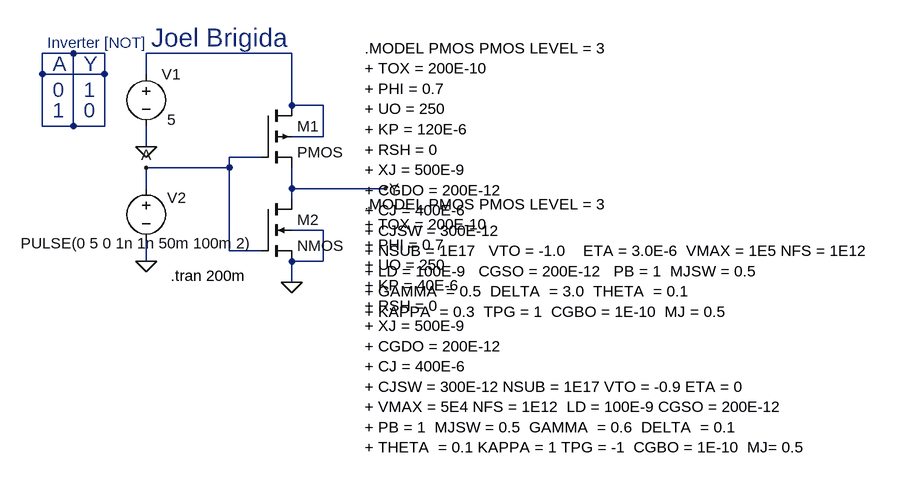
[diagram p0: schematic Inverter.asc]
Inverter.asc, the LTspice schematic file:
Version 4
SHEET 1 1240 680
WIRE -112 -32 -160 -32
WIRE -64 -32 -112 -32
WIRE 224 -32 0 -32
WIRE -160 0 -160 -32
WIRE -64 0 -64 -32
WIRE -64 0 -160 0
WIRE 0 0 0 -32
WIRE 224 48 224 -32
WIRE 272 48 224 48
WIRE -160 80 -160 0
WIRE -112 80 -112 -32
WIRE -112 80 -160 80
WIRE -64 80 -64 0
WIRE -64 80 -112 80
WIRE 272 96 272 48
WIRE 272 96 224 96
WIRE 0 112 0 80
WIRE 176 128 128 128
WIRE 128 144 128 128
WIRE 128 144 0 144
WIRE 0 176 0 144
WIRE 224 176 224 144
WIRE 368 176 224 176
WIRE 224 192 224 176
WIRE 272 240 224 240
WIRE 128 272 128 144
WIRE 176 272 128 272
WIRE 0 288 0 256
WIRE 272 288 272 240
WIRE 272 288 224 288
WIRE 224 320 224 288
FLAG 224 320 0
FLAG 0 112 0
FLAG 0 288 0
FLAG 368 176 Y
FLAG 0 144 A
SYMBOL pmos4 176 48 R0
SYMATTR InstName M1
SYMBOL nmos4 176 192 R0
SYMATTR InstName M2
SYMBOL voltage 0 -16 R0
WINDOW 123 0 0 Left 0
WINDOW 39 0 0 Left 0
WINDOW 3 32 86 Left 2
SYMATTR InstName V1
SYMATTR Value 5
SYMBOL voltage 0 160 R0
WINDOW 123 0 0 Left 0
WINDOW 39 0 0 Left 0
WINDOW 0 32 30 Left 2
WINDOW 3 -193 100 Left 2
SYMATTR InstName V2
SYMATTR Value PULSE(0 5 0 1n 1n 50m 100m 2)
TEXT 336 200 Left 2 !.MODEL PMOS PMOS LEVEL = 3\n+ TOX = 200E-10\n+ PHI = 0.7\n+ UO = 250 \n+ KP = 40E-6\n+ RSH = 0\n+ XJ = 500E-9 \n+ CGDO = 200E-12 \n+ CJ = 400E-6\n+ CJSW = 300E-12 NSUB = 1E17 VTO = -0.9 ETA = 0\n+ VMAX = 5E4 NFS = 1E12  LD = 100E-9 CGSO = 200E-12\n+ PB = 1  MJSW = 0.5  GAMMA  = 0.6  DELTA  = 0.1\n+ THETA  = 0.1 KAPPA = 1 TPG = -1  CGBO = 1E-10  MJ= 0.5
TEXT 336 -40 Left 2 !.MODEL PMOS PMOS LEVEL = 3\n+ TOX = 200E-10\n+ PHI = 0.7\n+ UO = 250\n+ KP = 120E-6\n+ RSH = 0\n+ XJ = 500E-9\n+ CGDO = 200E-12\n+ CJ = 400E-6\n+ CJSW = 300E-12\n+ NSUB = 1E17   VTO = -1.0    ETA = 3.0E-6  VMAX = 1E5 NFS = 1E12   \n+ LD = 100E-9   CGSO = 200E-12   PB = 1  MJSW = 0.5\n+ GAMMA  = 0.5  DELTA  = 3.0  THETA  = 0.1\n+ KAPPA  = 0.3  TPG = 1  CGBO = 1E-10  MJ = 0.5
TEXT 8 -56 Left 4 ;Joel Brigida
TEXT -144 -16 Left 3 ;A
TEXT -96 -16 Left 3 ;Y
TEXT -144 24 Left 3 ;0
TEXT -96 56 Left 3 ;0
TEXT -144 56 Left 3 ;1
TEXT -96 24 Left 3 ;1
TEXT -152 -48 Left 2 ;Inverter [NOT]
TEXT 38 310 Left 2 !.tran 200m

The netlist it stands for:
* Inverter.asc
M1 N002 A Y N002 PMOS
M2 Y A 0 0 NMOS
V1 N002 0 5
V2 A 0 PULSE(0 5 0 1n 1n 50m 100m 2)
.model NMOS NMOS
.model PMOS PMOS
.lib standard.mos
.MODEL PMOS PMOS LEVEL = 3
+ TOX = 200E-10
+ PHI = 0.7
+ UO = 250
+ KP = 40E-6
+ RSH = 0
+ XJ = 500E-9
+ CGDO = 200E-12
+ CJ = 400E-6
+ CJSW = 300E-12 NSUB = 1E17 VTO = -0.9 ETA = 0
+ VMAX = 5E4 NFS = 1E12  LD = 100E-9 CGSO = 200E-12
+ PB = 1  MJSW = 0.5  GAMMA  = 0.6  DELTA  = 0.1
+ THETA  = 0.1 KAPPA = 1 TPG = -1  CGBO = 1E-10  MJ= 0.5
.MODEL PMOS PMOS LEVEL = 3
+ TOX = 200E-10
+ PHI = 0.7
+ UO = 250
+ KP = 120E-6
+ RSH = 0
+ XJ = 500E-9
+ CGDO = 200E-12
+ CJ = 400E-6
+ CJSW = 300E-12
+ NSUB = 1E17   VTO = -1.0    ETA = 3.0E-6  VMAX = 1E5 NFS = 1E12
+ LD = 100E-9   CGSO = 200E-12   PB = 1  MJSW = 0.5
+ GAMMA  = 0.5  DELTA  = 3.0  THETA  = 0.1
+ KAPPA  = 0.3  TPG = 1  CGBO = 1E-10  MJ = 0.5
* Joel Brigida
* A
* Y
* 0
* 0
* 1
* 1
* Inverter [NOT]
.tran 200m
.backanno
.end